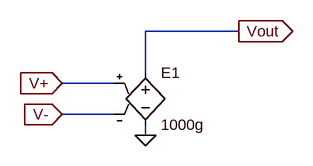
[diagram p0: schematic NutriOpAmp.asc]
NutriOpAmp.asc, the LTspice schematic file:
Version 4
SHEET 1 880 680
WIRE 352 64 208 64
WIRE 208 128 208 64
WIRE 160 144 80 144
WIRE 160 192 80 192
WIRE 208 224 208 208
FLAG 208 224 0
FLAG 80 144 V+
IOPIN 80 144 In
FLAG 80 192 V-
IOPIN 80 192 In
FLAG 352 64 Vout
IOPIN 352 64 Out
SYMBOL e 208 112 R0
SYMATTR InstName E1
SYMATTR Value 1000g

The netlist it stands for:
* NutriOpAmp.asc
E1 Vout 0 V+ V- 1000g
.backanno
.end